# Altium schematic sheet XLIN1.7-2048SQ TE0_MB.SchDoc
size A3; Address1: Address1; Address2: Address2; Address3: Address3; Address4: Address4; DocumentNumber: АБВГ.123456.001 Э3; SheetNumber: 1; Scale: 1:1; DocumentType: Схема электрическая принципиальная; FirstReferrence: АБВГ.123456.001
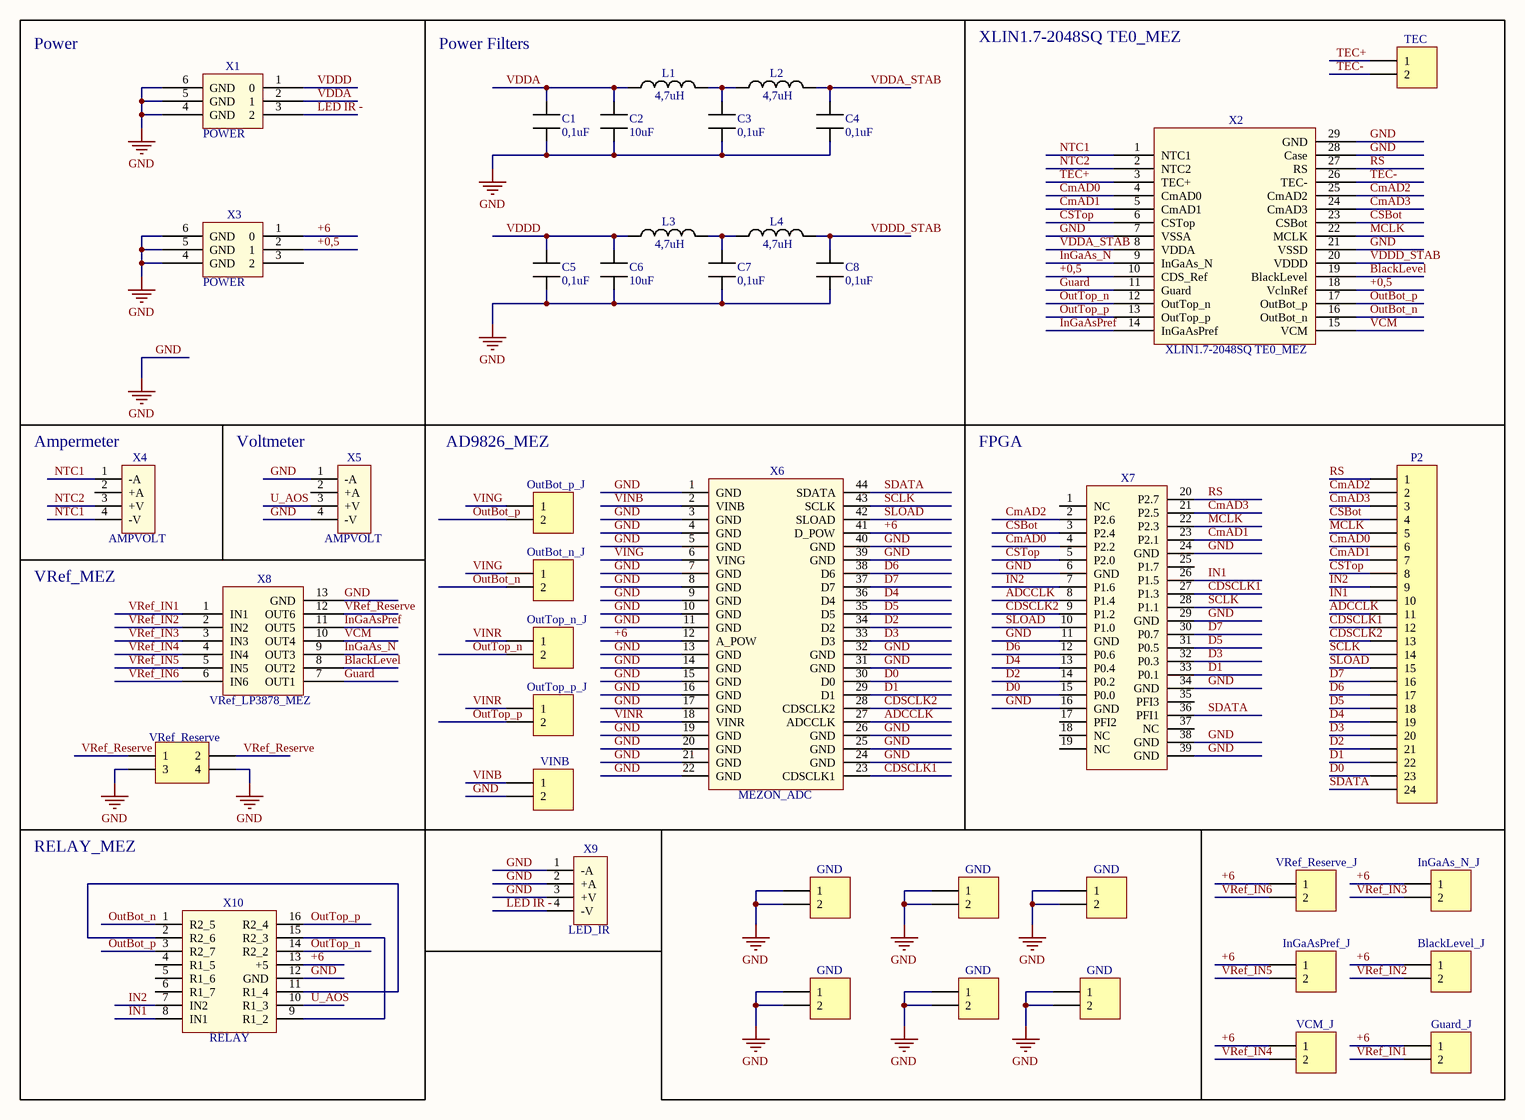
[diagram p0: XLIN1.7-2048SQ TE0_MB.SchDoc]

## Parts
C1  0,1uF  [CAP_0603]
C2  10uF  [CAP_1812]
C3  0,1uF  [CAP_0603]
C4  0,1uF  [CAP_0603]
C5  0,1uF  [CAP_0603]
C6  10uF  [CAP_1812]
C7  0,1uF  [CAP_0603]
C8  0,1uF  [CAP_0603]
L1  4,7uH  [IND_0805]
L2  4,7uH  [IND_0805]
L3  4,7uH  [IND_0805]
L4  4,7uH  [IND_0805]
P1  TEC  [HDR1X2]
P2  Header 24  [HDR1X24]  (value not drawn)
P3  OutBot_p_J  [HDR1X2]
P4  OutBot_n_J  [HDR1X2]
P5  OutTop_n_J  [HDR1X2]
P6  OutTop_p_J  [HDR1X2]
P7  VRef_Reserve  [HDR2X2]
P8  VINB  [HDR1X2]
P9  VRef_Reserve_J  [HDR1X2]
P10  InGaAs_N_J  [HDR1X2]
P11  GND  [HDR1X2]
P12  GND  [HDR1X2]
P13  GND  [HDR1X2]
P14  InGaAsPref_J  [HDR1X2]
P15  BlackLevel_J  [HDR1X2]
P16  GND  [HDR1X2]
P17  GND  [HDR1X2]
P18  GND  [HDR1X2]
P19  VCM_J  [HDR1X2]
P20  Guard_J  [HDR1X2]
X1  POWER  [POWER]
X2  XLIN1.7-2048SQ TE0_MEZ  [XLIN1.7-2048SQ TE0_MEZ]
X3  POWER  [POWER]
X4  AMPVOLT  [AMP_VOLTMETER]
X5  AMPVOLT  [AMP_VOLTMETER]
X6  MEZON_ADC  [MEZON_ADC]
X7  CHEAP_CON_37_FEMALE  [CHEAP_CONN_FEMALE]  (value not drawn)
X8  VRef_LP3878_MEZ  [VRef_LP3878_MEZ]
X9  LED_IR  [AMP_VOLTMETER]
X10  RELAY  [RELAY_MODULE]

## Blocks framed on the sheet
Power: X1 X3

## Nets
GND: C1.1 C2.1 C3.1 C4.1 C5.1 C6.1 C7.1 C8.1 P7.3 P7.4 P8.2 P11.1 P11.2 P12.1 P12.2 P13.1 P13.2 P16.1 P16.2 P17.1 P17.2 P18.1 P18.2 X1.4(GND) X1.5(GND) X1.6(GND) X2.7(VSSA) X2.21(VSSD) X2.28(Case) X2.29(GND) X3.4(GND) X3.5(GND) X3.6(GND) X5.1(-A) X5.4(-V) X6.1(GND) X6.3(GND) X6.4(GND) X6.5(GND) X6.7(GND) X6.8(GND) X6.9(GND) X6.10(GND) X6.11(GND) X6.13(GND) X6.14(GND) X6.15(GND) X6.16(GND) X6.17(GND) X6.19(GND) X6.20(GND) X6.21(GND) X6.22(GND) X6.24(GND) X6.25(GND) X6.26(GND) X6.31(GND) X6.32(GND) X6.39(GND) X6.40(GND) X7.6(GND) X7.11(GND) X7.16(GND) X7.24(GND) X7.29(GND) X7.34(GND) X7.38(GND) X7.39(GND) X8.13(GND) X9.1(-A) X9.2(+A) X9.3(+V) X10.12(GND)
+0,5: X2.10(CDS_Ref) X2.18(VclnRef) X3.2(1)
+6: P9.1 P10.1 P14.1 P15.1 P19.1 P20.1 X3.1(0) X6.12(A_POW) X6.41(D_POW) X10.13(+5)
ADCCLK: P2.11 X6.27(ADCCLK) X7.8(P1.4)
BlackLevel: X2.19(BlackLevel) X8.8(OUT2)
CDSCLK1: P2.12 X6.23(CDSCLK1) X7.27(P1.3)
CDSCLK2: P2.13 X6.28(CDSCLK2) X7.9(P1.2)
CmAD0: P2.6 X2.4(CmAD0) X7.4(P2.2)
CmAD1: P2.7 X2.5(CmAD1) X7.23(P2.1)
CmAD2: P2.2 X2.25(CmAD2) X7.2(P2.6)
CmAD3: P2.3 X2.24(CmAD3) X7.21(P2.5)
CSBot: P2.4 X2.23(CSBot) X7.3(P2.4)
CSTop: P2.8 X2.6(CSTop) X7.5(P2.0)
D0: P2.23 X6.30(D0) X7.15(P0.0)
D1: P2.22 X6.29(D1) X7.33(P0.1)
D2: P2.21 X6.34(D2) X7.14(P0.2)
D3: P2.20 X6.33(D3) X7.32(P0.3)
D4: P2.19 X6.36(D4) X7.13(P0.4)
D5: P2.18 X6.35(D5) X7.31(P0.5)
D6: P2.17 X6.38(D6) X7.12(P0.6)
D7: P2.16 X6.37(D7) X7.30(P0.7)
Guard: X2.11(Guard) X8.7(OUT1)
IN1: P2.10 X7.26(P1.5) X10.8(IN1)
IN2: P2.9 X7.7(P1.6) X10.7(IN2)
InGaAs_N: X2.9(InGaAs_N) X8.9(OUT3)
InGaAsPref: X2.14(InGaAsPref) X8.11(OUT5)
LED IR -: X1.3(2) X9.4(-V)
MCLK: P2.5 X2.22(MCLK) X7.22(P2.3)
NTC1: X2.1(NTC1) X4.1(-A) X4.4(-V)
NTC2: X2.2(NTC2) X4.3(+V)
OutBot_n: P4.2 X2.16(OutBot_n) X10.1(R2_5)
OutBot_p: P3.2 X2.17(OutBot_p) X10.3(R2_7)
OutTop_n: P5.2 X2.12(OutTop_n) X10.14(R2_2)
OutTop_p: P6.2 X2.13(OutTop_p) X10.16(R2_4)
RS: P2.1 X2.27(RS) X7.20(P2.7)
SCLK: P2.14 X6.43(SCLK) X7.28(P1.1)
SDATA: P2.24 X6.44(SDATA) X7.36(PFI1)
SLOAD: P2.15 X6.42(SLOAD) X7.10(P1.0)
TEC+: P1.1 X2.3(TEC+)
TEC-: P1.2 X2.26(TEC-)
U_AOS: X5.3(+V) X10.10(R1_3)
VCM: X2.15(VCM) X8.10(OUT4)
VDDA: C1.2 C2.2 L1.1 X1.2(1)
VDDA_STAB: C4.2 L2.2 X2.8(VDDA)
VDDD: C5.2 C6.2 L3.1 X1.1(0)
VDDD_STAB: C8.2 L4.2 X2.20(VDDD)
VINB: P8.1 X6.2(VINB)
VING: P3.1 P4.1 X6.6(VING)
VINR: P5.1 P6.1 X6.18(VINR)
VRef_IN1: P20.2 X8.1(IN1)
VRef_IN2: P15.2 X8.2(IN2)
VRef_IN3: P10.2 X8.3(IN3)
VRef_IN4: P19.2 X8.4(IN4)
VRef_IN5: P14.2 X8.5(IN5)
VRef_IN6: P9.2 X8.6(IN6)
VRef_Reserve: P7.1 P7.2 X8.12(OUT6)
NetC3_2: C3.2 L1.2 L2.1
NetC7_2: C7.2 L3.2 L4.1
NetX10_2: X10.2(R2_6) X10.11(R1_4)
NetX10_9: X10.9(R1_2) X10.15(R2_3)

Not connected (* = marked no-connect by the designer): X3 3(2); X4 2(+A); X5 2(+A); X7 1(NC) 17(PFI2) 18(NC) 19(NC) 25(P1.7) 35(PFI3) 37(NC); X10 4(R1_5) 5(R1_6) 6(R1_7)

## Notes on the sheet
- Power Filters
- XLIN1.7-2048SQ TE0_MEZ
- (near X4) Ampermeter
- (near X5) Voltmeter
- AD9826_MEZ
- FPGA
- (near X4) VRef_MEZ
- RELAY_MEZ
- Title
- Size:
- Date:
- A3
- Number:
- Time:
- Revision:
- Sheet
- of
- File:

## Library data of the parts
C1-C8 = CAP
L1-L4 = IND
P1 P3-P6 P8-P20 = Header 2: Header, 2-Pin; LatestRevisionDate: 17-Jul-2002; LatestRevisionNote: Re-released for DXP Platform.; Publisher: Altium Limited
P2 = Header 24: Header, 24-Pin; LatestRevisionDate: 17-Jul-2002; LatestRevisionNote: Re-released for DXP Platform.; Publisher: Altium Limited
P7 = Header 2X2: Header, 2-Pin, Dual row; LatestRevisionDate: 17-Jul-2002; LatestRevisionNote: Re-released for DXP Platform.; Publisher: Altium Limited
X4 X5 X9 = AMP_VOLTMETER
X10 = MEZON_RELAY